# EAGLE design untitled (EAGLE 7.2.0)
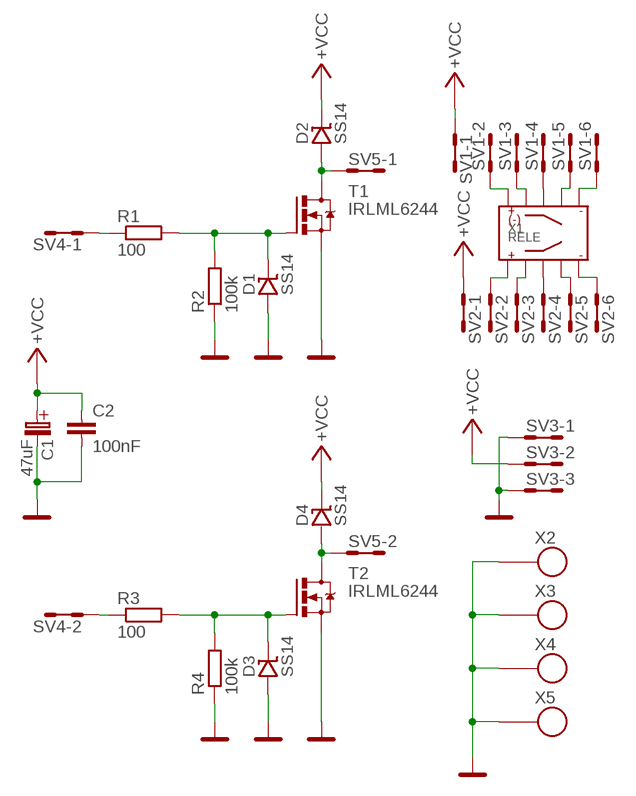
[diagram p0: schematic, sheet 1]

## Parts
C1  47uF  B  [B]
C2  100nF  C0805  [C0805]
D1  SS14  D-SHOTKY-SMA  [SMA]
D2  SS14  D-SHOTKY-SMA  [SMA]
D3  SS14  D-SHOTKY-SMA  [SMA]
D4  SS14  D-SHOTKY-SMA  [SMA]
R1  100  R0805  [0805]
R2  100k  R0805  [0805]
R3  100  R0805  [0805]
R4  100k  R0805  [0805]
SV1  MA06-2  [MA06-2]
SV2  MA06-2  [MA06-2]
SV3  MA03-2  [MA03-2]
SV4  MA02-2  [MA02-2]
SV5  MA02-2  [MA02-2]
T1  IRLML6244  IRLML6244TRPBF  [SOT23]
T2  IRLML6244  IRLML6244TRPBF  [SOT23]
X1  RELE  [RELE]
X2  SROUB3M  [SROUB3M]
X3  SROUB3M  [SROUB3M]
X4  SROUB3M  [SROUB3M]
X5  SROUB3M  [SROUB3M]

## Nets
+VCC: C1.+(C_EL+) C2.1 D2.K D4.K SV1.1 SV1.2 SV2.1 SV2.2 SV3.3 SV3.4
GND: C1.-(C_EL-) C2.2 D1.A D3.A R2.1 R4.1 SV3.1 SV3.2 SV3.5 SV3.6 T1.2(S) T2.2(S) X2.P$1 X3.P$1 X4.P$1 X5.P$1
N$1: D2.A SV5.1 SV5.2 T1.3(D)
N$2: D1.K R1.2 R2.2 T1.1(G)
N$3: D4.A SV5.3 SV5.4 T2.3(D)
N$4: D3.K R3.2 R4.2 T2.1(G)
N$5: SV1.3 SV1.4 X1.10
N$6: SV1.5 SV1.6 X1.9
N$7: SV1.7 SV1.8 X1.8
N$8: SV1.9 SV1.10 X1.7
N$9: SV1.11 SV1.12 X1.6
N$10: SV2.3 SV2.4 X1.1
N$11: SV2.5 SV2.6 X1.2
N$12: SV2.7 SV2.8 X1.3
N$13: SV2.9 SV2.10 X1.4
N$14: SV2.11 SV2.12 X1.5
N$15: R1.1 SV4.1 SV4.2
N$16: R3.1 SV4.3 SV4.4

## Library data of the parts
C1 = moje_C:B
C2 = moje_C:C0805
D1-D4 = moje_diody:D-SHOTKY-SMA
R1-R4 = moje_R:R0805
SV1 SV2 = moje_hrebinky:MA06-2: PIN HEADER; OC_FARNELL: unknown; OC_NEWARK: unknown
SV3 = moje_hrebinky:MA03-2: PIN HEADER; OC_FARNELL: unknown; OC_NEWARK: unknown
SV4 SV5 = moje_hrebinky:MA02-2
T1 T2 = moje_T:IRLML6244TRPBF: HEXFET Power MOSFET
X1 = moje_tlacitka:RELE
X2-X5 = moje:SROUB3M

## Board
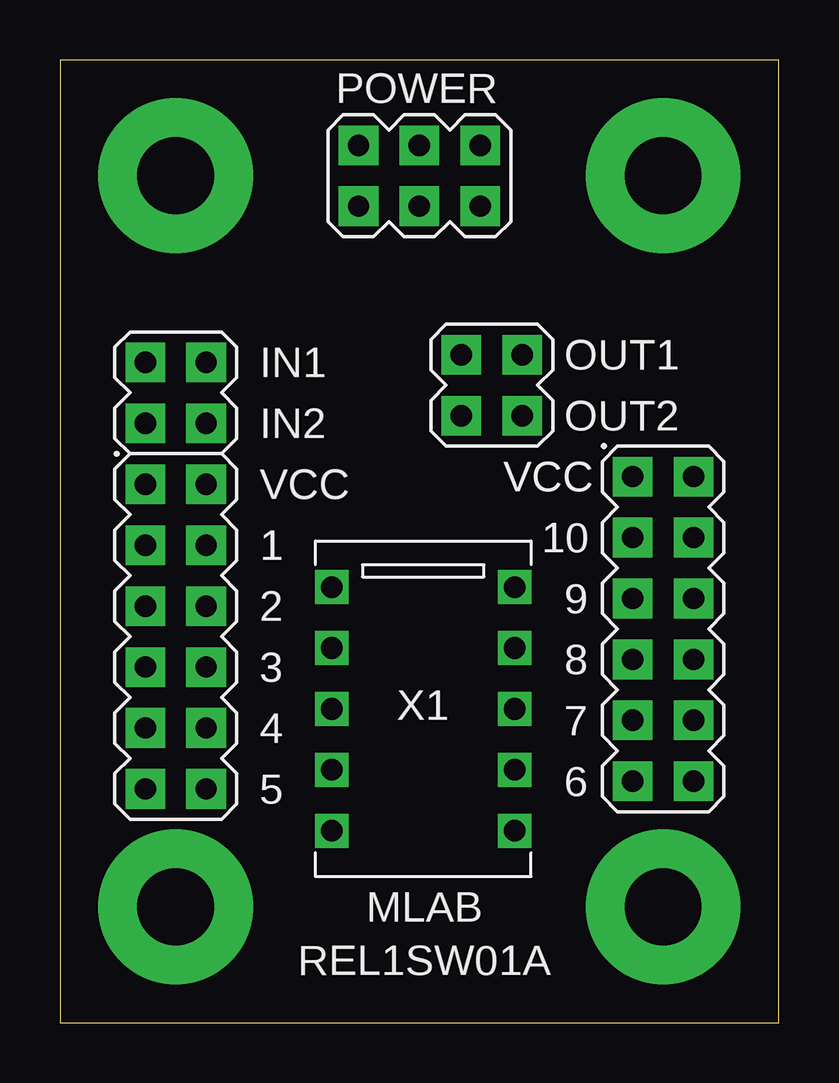
[diagram p1: board, top side]
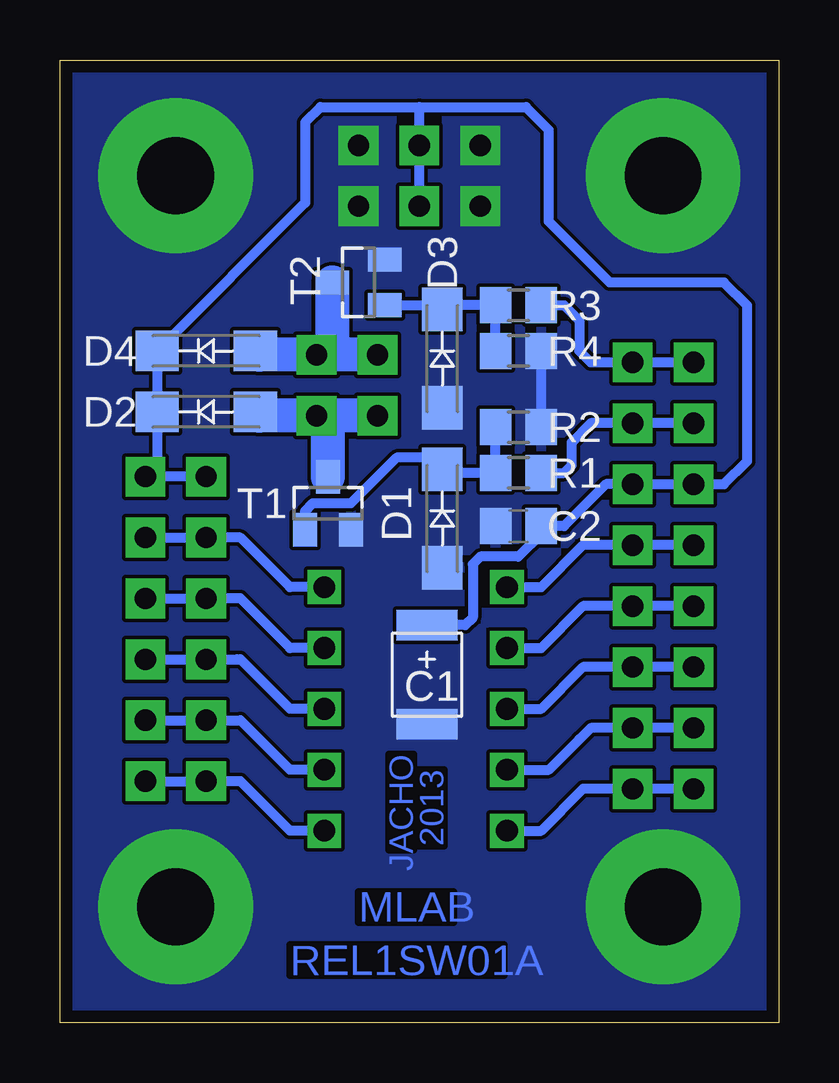
[diagram p2: board, bottom side, seen from below]

Size 29.97 x 40.13 mm. Coordinates in mm from the lower left corner, seen from the top.
Outline: 0,0 29.97,0 29.97,40.13 0,40.13 0,0
Copper layers (1*16): Top 0.035mm / dielectric 1.5mm / Bottom 0.035mm
Design rules "default": minimum track width 8mil, minimum drill 16mil, track to track 6mil, track to pad 6mil, pad to pad 6mil, via to via 6mil, smd to smd 6mil, copper to edge 20mil, drill to drill 8mil, minimum pad ring 10mil, minimum via ring 8mil, stop-mask expansion 4mil, vias tented up to drill 25mil, thermal gap 0mil

### Footprints (pad centres in the part's own frame; a part is rotated, then mirrored left to right if it is on the bottom)
B = smd 1.27 x 2.54: + 2.223,0; - -1.905,0
C0805 = smd 1.3 x 1.5: 1 -0.95,0; 2 0.95,0
SMA = smd 1.8 x 1.7: A -2.05,0; K 2.05,0
0805 = smd 1.3 x 1.5: 1 -0.95,0; 2 0.95,0
MA06-2 = drill 0.889 pad 1.651 square: 1 -6.35,-1.27; 2 -6.35,1.27; 3 -3.81,-1.27; 4 -3.81,1.27; 5 -1.27,-1.27; 6 -1.27,1.27; 7 1.27,-1.27; 8 1.27,1.27; 9 3.81,-1.27; 10 3.81,1.27; 11 6.35,-1.27; 12 6.35,1.27
MA03-2 = drill 0.889 pad 1.651 square: 1 -2.54,-1.27; 2 -2.54,1.27; 3 0,-1.27; 4 0,1.27; 5 2.54,-1.27; 6 2.54,1.27
MA02-2 = drill 0.889 pad 1.651 square: 1 -1.27,-1.27; 2 -1.27,1.27; 3 1.27,-1.27; 4 1.27,1.27
SOT23 = smd 1 x 1.4: 1 -0.95,-1.1; 2 0.95,-1.1; 3 0,1.1
RELE = drill 0.9 square: 1 -5.08,-3.81; 2 -2.54,-3.81; 3 0,-3.81; 4 2.54,-3.81; 5 5.08,-3.81; 6 5.08,3.81; 7 2.54,3.81; 8 0,3.81; 9 -2.54,3.81; 10 -5.08,3.81
SROUB3M = drill 3.2 pad 6.452: P$1 0,0

### Placement (x,y rotation side)
C1  14.67,14.35 90 bottom
C2  10.86,20.7 180 bottom
D1  14.03,21.02 90 bottom
D2  23.88,25.46 180 bottom
D3  14.03,27.69 90 bottom
D4  23.88,28 180 bottom
R1  10.86,22.92 180 bottom
R2  10.86,24.83 180 bottom
R3  10.86,29.91 180 bottom
R4  10.86,28 180 bottom
SV1  25.15,16.41 270 top
SV2  4.83,16.1 270 top
SV3  14.99,35.31 180 top
SV4  4.83,26.26 90 top
SV5  18,26.57 90 top
T1  18.8,21.65 0 bottom
T2  17.53,30.86 90 bottom
X1  15.14,13.08 270 top
X2  4.83,4.83 0 top
X3  4.83,35.31 0 top
X4  25.15,4.83 0 top
X5  25.15,35.31 0 top

### Tracks (layer width: path | path; a pad name or v marks a point on that pad's centre or on a via)
+VCC
  Bottom 0.406: SV1.1 25.78,22.76 | 25.78,22.76 SV1.2 | 25.78,22.76 25.93,22.91 D2.K D4.K 19.75,34.18 19.75,37.53 19.11,38.16 14.99,38.16 | SV3.4 SV3.3 14.99,38.16 | SV2.2 SV2.1 | SV2.2 2.29,22.45 1.33,23.4 1.33,29.91 2.29,30.86 7.05,30.86 9.59,33.4 9.59,37.21 10.54,38.16 14.99,38.16 | SV2.2 7.21,22.45 8.95,20.7 C2.1 9.91,20.38 10.86,19.43 12.45,19.43 12.76,19.11 12.76,16.89 13.08,16.57 C1.+
GND
  Bottom 0.406: R2.1 R4.1
  pour Bottom: -0.25,79.44 -0.25,-3.11 48.64,-3.11 48.64,78.49 11.81,78.49 11.81,80.07 0.06,80.07 0.06,79.76
N$1
  Bottom 1.422: SV5.2 SV5.1 | SV5.1 21.67,25.3 D2.A | T1.3 18.8,24.83 SV5.1
N$2
  Bottom 0.406: T1.1 19.75,21.34 19.43,21.65 17.84,21.65 15.94,23.56 14.35,23.56 14.03,23.24 D1.K 13.89,22.92 R1.2 R2.2
N$3
  Bottom 1.422: SV5.4 SV5.3 | SV5.3 21.67,27.84 D4.A | T2.3 18.63,28.17 18.8,28 18.95,27.84 SV5.3
N$4
  Bottom 0.406: T2.1 14.49,29.91 D3.K 13.86,29.91 R3.2 R4.2
N$5
  Bottom 0.406: X1.10 20.38,18.16 22.45,20.22 SV1.3 SV1.4
N$6
  Bottom 0.406: X1.9 20.38,15.62 22.45,17.68 SV1.5 SV1.6
N$7
  Bottom 0.406: X1.8 20.38,13.08 22.45,15.14 22.61,15.14 SV1.7 SV1.8
N$8
  Bottom 0.406: X1.7 20.38,10.54 22.45,12.61 SV1.9 SV1.10
N$9
  Bottom 0.406: X1.6 20.38,8 22.45,10.07 SV1.11 SV1.12
N$10
  Bottom 0.406: SV2.3 SV2.4 8.16,19.91 9.91,18.16 X1.1
N$11
  Bottom 0.406: SV2.5 SV2.6 8.16,17.37 9.91,15.62 X1.2
N$12
  Bottom 0.406: SV2.7 SV2.8 8.16,14.83 9.91,13.08 X1.3
N$13
  Bottom 0.406: SV2.9 SV2.10 7.84,12.29 8.32,11.81 8.64,11.49 9.59,10.54 X1.4
N$14
  Bottom 0.406: SV2.11 SV2.12 8.16,9.75 9.91,8 X1.5
N$15
  Bottom 0.406: SV4.2 SV4.1 7.84,24.99 8.64,24.19 8.64,23.24 8.95,22.92 R1.1
N$16
  Bottom 0.406: SV4.4 SV4.3 | SV4.3 6.57,27.53 | R3.1 8.95,29.91 8.32,29.27 8.32,28 7.84,27.53 SV4.3

### Text on the board
Bottom: 2013 | JACHO | MLAB | REL1SW01A
tPlace: POWER | IN1 | OUT1 | IN2 | OUT2 | VCC | VCC | 1 | 10 | 2 | 9 | 8 | 3 | 4 | 7 | 6 | 5 | MLAB | REL1SW01A